# EAGLE design PCB-BI8-2x8 (EAGLE 7.7.0)

## Sheet 1 of 2
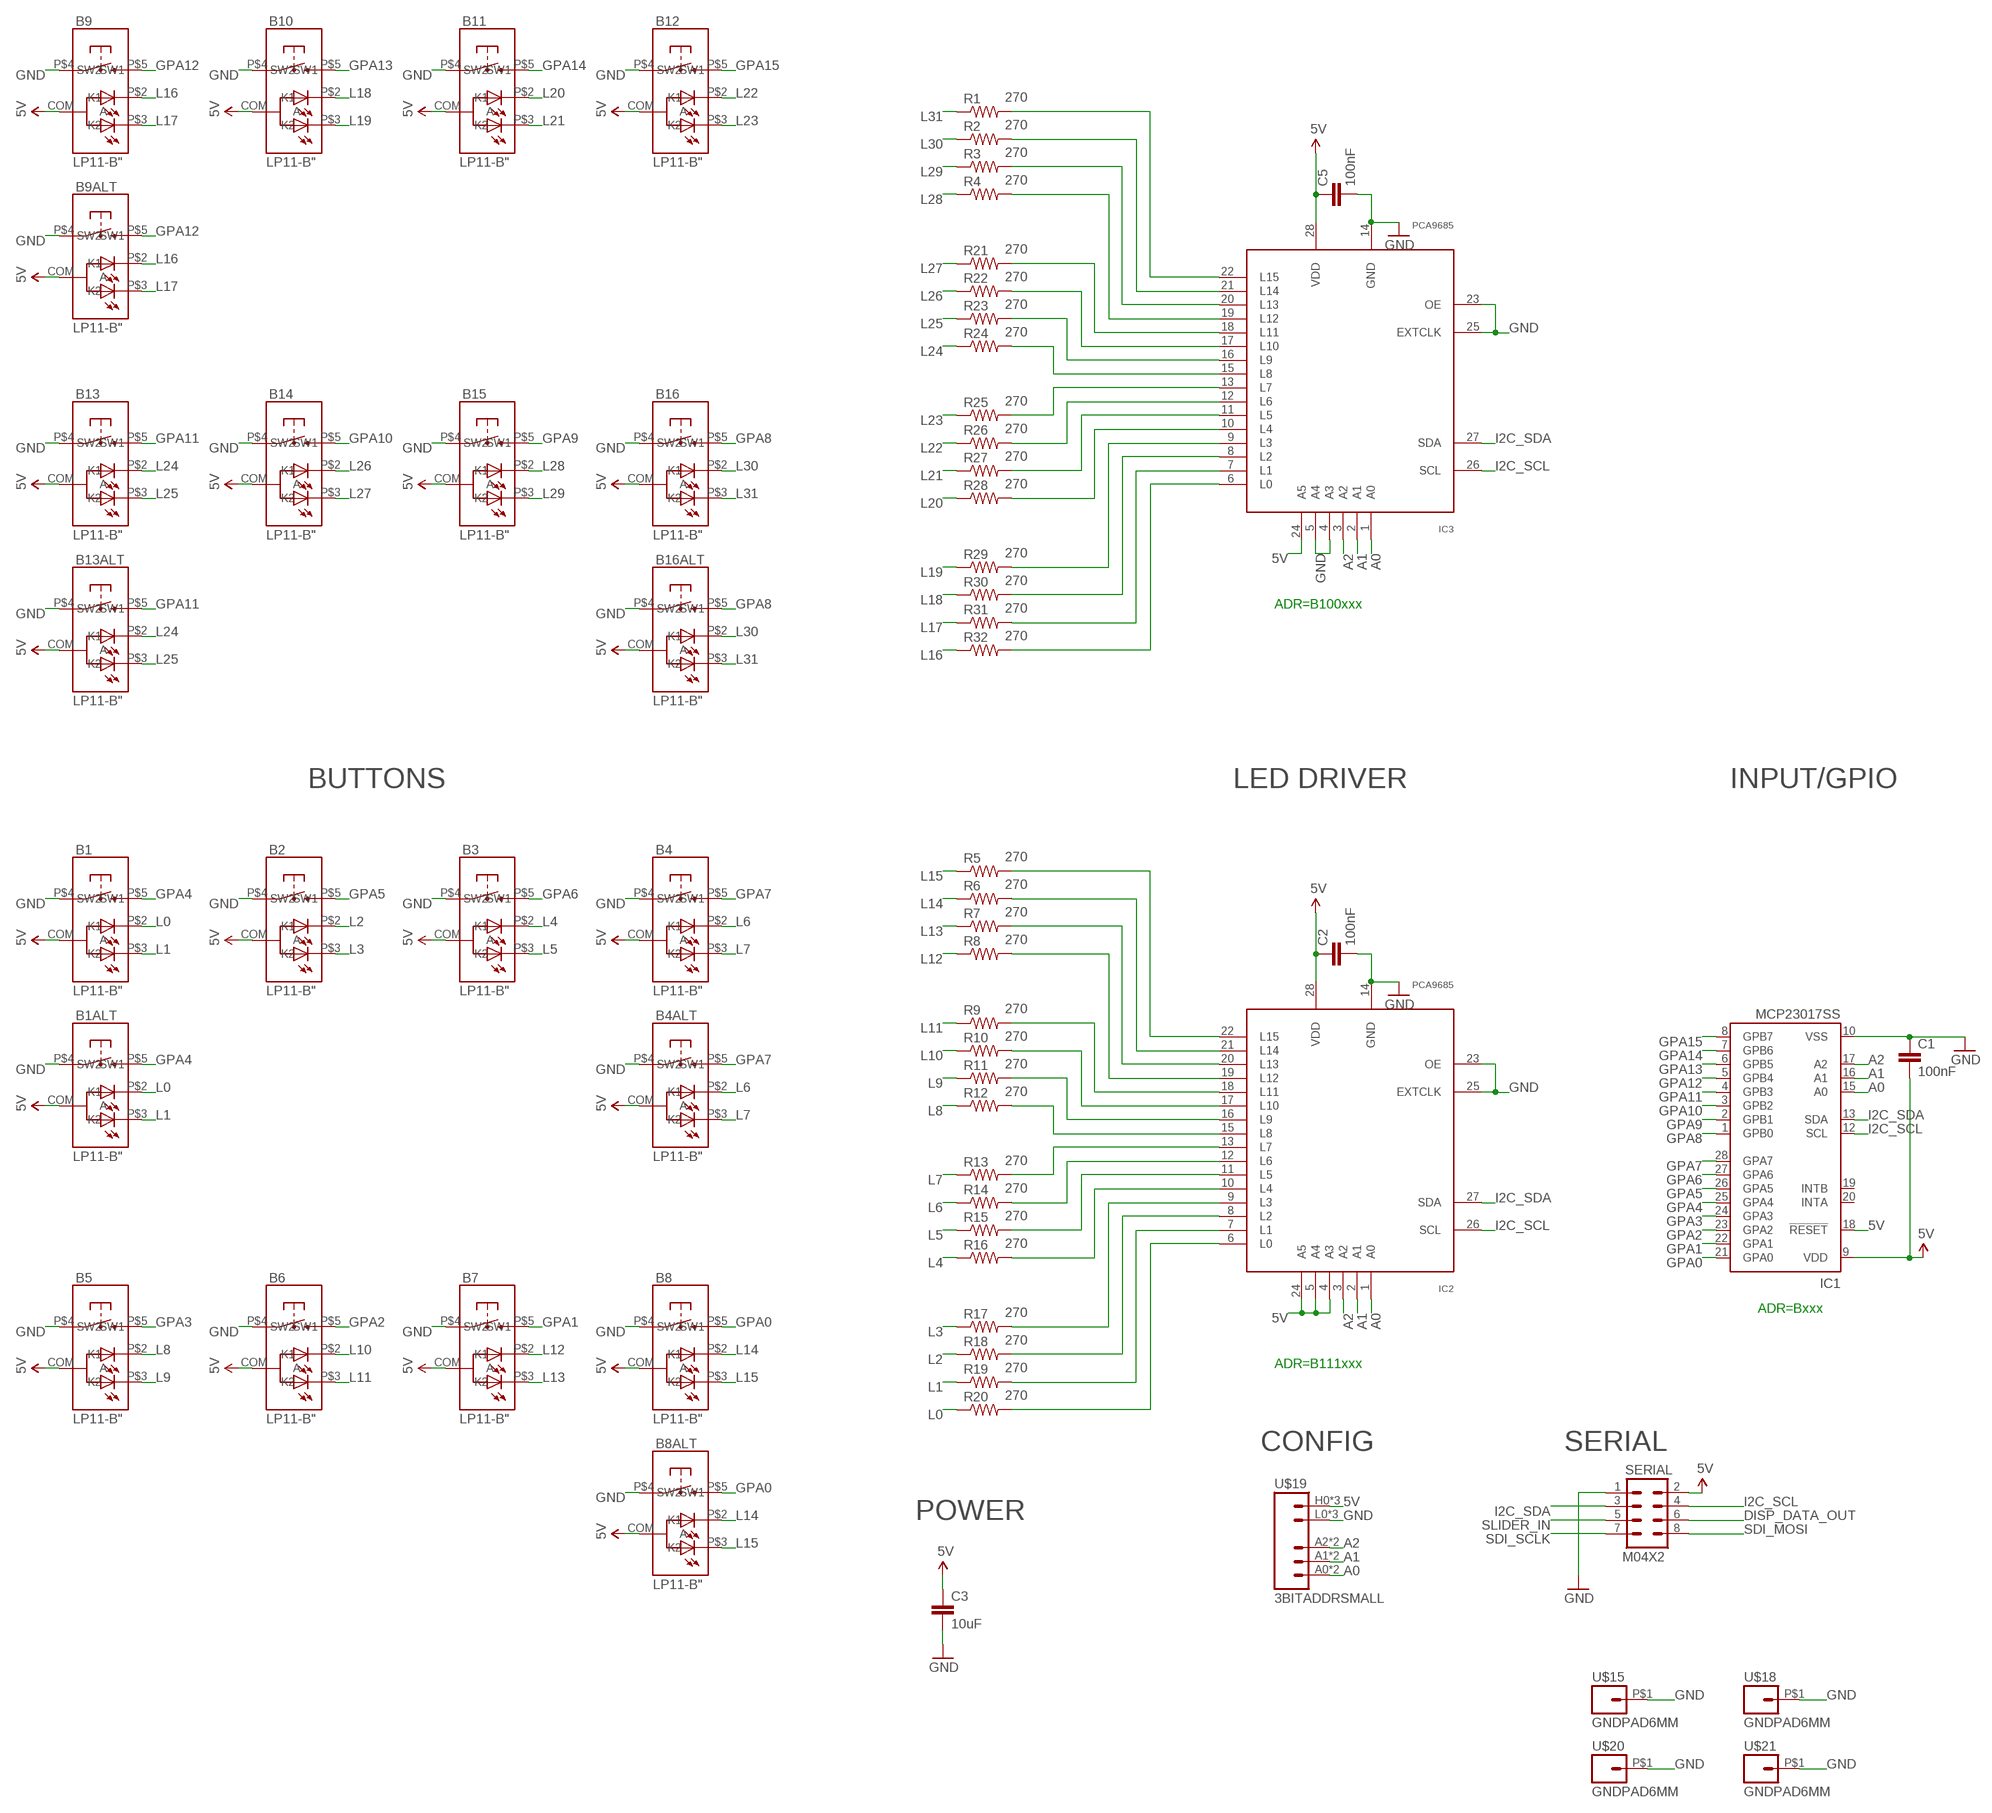
[diagram p0: schematic, sheet 1]

### Parts
B1  LP11-B"  [LP11]
B1ALT  LP11-B"  [LP11]
B2  LP11-B"  [LP11]
B3  LP11-B"  [LP11]
B4  LP11-B"  [LP11]
B4ALT  LP11-B"  [LP11]
B5  LP11-B"  [LP11]
B6  LP11-B"  [LP11]
B7  LP11-B"  [LP11]
B8  LP11-B"  [LP11]
B8ALT  LP11-B"  [LP11]
B9  LP11-B"  [LP11]
B9ALT  LP11-B"  [LP11]
B10  LP11-B"  [LP11]
B11  LP11-B"  [LP11]
B12  LP11-B"  [LP11]
B13  LP11-B"  [LP11]
B13ALT  LP11-B"  [LP11]
B14  LP11-B"  [LP11]
B15  LP11-B"  [LP11]
B16  LP11-B"  [LP11]
B16ALT  LP11-B"  [LP11]
C1  100nF  CAP0603-CAP  [0603-CAP]
C2  100nF  CAP0603-CAP  [0603-CAP]
C3  10uF  CAP0805  [0805]
C5  100nF  CAP0603-CAP  [0603-CAP]
IC1  MCP23017SS  [SSOP28]
IC2  PCA9685  [TSSOP28]
IC3  PCA9685  [TSSOP28]
R1  270  RESISTOR0603-RES  [0603-RES]
R2  270  RESISTOR0603-RES  [0603-RES]
R3  270  RESISTOR0603-RES  [0603-RES]
R4  270  RESISTOR0603-RES  [0603-RES]
R5  270  RESISTOR0603-RES  [0603-RES]
R6  270  RESISTOR0603-RES  [0603-RES]
R7  270  RESISTOR0603-RES  [0603-RES]
R8  270  RESISTOR0603-RES  [0603-RES]
R9  270  RESISTOR0603-RES  [0603-RES]
R10  270  RESISTOR0603-RES  [0603-RES]
R11  270  RESISTOR0603-RES  [0603-RES]
R12  270  RESISTOR0603-RES  [0603-RES]
R13  270  RESISTOR0603-RES  [0603-RES]
R14  270  RESISTOR0603-RES  [0603-RES]
R15  270  RESISTOR0603-RES  [0603-RES]
R16  270  RESISTOR0603-RES  [0603-RES]
R17  270  RESISTOR0603-RES  [0603-RES]
R18  270  RESISTOR0603-RES  [0603-RES]
R19  270  RESISTOR0603-RES  [0603-RES]
R20  270  RESISTOR0603-RES  [0603-RES]
R21  270  RESISTOR0603-RES  [0603-RES]
R22  270  RESISTOR0603-RES  [0603-RES]
R23  270  RESISTOR0603-RES  [0603-RES]
R24  270  RESISTOR0603-RES  [0603-RES]
R25  270  RESISTOR0603-RES  [0603-RES]
R26  270  RESISTOR0603-RES  [0603-RES]
R27  270  RESISTOR0603-RES  [0603-RES]
R28  270  RESISTOR0603-RES  [0603-RES]
R29  270  RESISTOR0603-RES  [0603-RES]
R30  270  RESISTOR0603-RES  [0603-RES]
R31  270  RESISTOR0603-RES  [0603-RES]
R32  270  RESISTOR0603-RES  [0603-RES]
SERIAL  M04X2  [2X4]
U$15  GNDPAD6MM  [3.2MMPAD6MM]
U$18  GNDPAD6MM  [3.2MMPAD6MM]
U$19  3BITADDRSMALL  [3BITADDR_SMALL]
U$20  GNDPAD6MM  [3.2MMPAD6MM]
U$21  GNDPAD6MM  [3.2MMPAD6MM]

### Nets
5V [Power]: B1.COM(A) B1ALT.COM(A) B2.COM(A) B3.COM(A) B4.COM(A) B4ALT.COM(A) B5.COM(A) B6.COM(A) B7.COM(A) B8.COM(A) B8ALT.COM(A) B9.COM(A) B9ALT.COM(A) B10.COM(A) B11.COM(A) B12.COM(A) B13.COM(A) B13ALT.COM(A) B14.COM(A) B15.COM(A) B16.COM(A) B16ALT.COM(A) C1.2 C2.1 C3.1 C5.1 IC1.9(VDD) IC1.18(!RESET) IC2.4(A3) IC2.5(A4) IC2.24(A5) IC2.28(VDD) IC3.24(A5) IC3.28(VDD) SERIAL.2 U$19.H0(VCC) U$19.H1(VCC) U$19.H2(VCC)
A0: IC1.15(A0) IC2.1(A0) IC3.1(A0) U$19.A0 U$19.AS0(A0)
A1: IC1.16(A1) IC2.2(A1) IC3.2(A1) U$19.A1 U$19.AS1(A1)
A2: IC1.17(A2) IC2.3(A2) IC3.3(A2) U$19.A2 U$19.AS2(A2)
DISP_DATA_OUT: SERIAL.6
GND [Power]: B1.P$4(SW1) B1ALT.P$4(SW1) B2.P$4(SW1) B3.P$4(SW1) B4.P$4(SW1) B4ALT.P$4(SW1) B5.P$4(SW1) B6.P$4(SW1) B7.P$4(SW1) B8.P$4(SW1) B8ALT.P$4(SW1) B9.P$4(SW1) B9ALT.P$4(SW1) B10.P$4(SW1) B11.P$4(SW1) B12.P$4(SW1) B13.P$4(SW1) B13ALT.P$4(SW1) B14.P$4(SW1) B15.P$4(SW1) B16.P$4(SW1) B16ALT.P$4(SW1) C1.1 C2.2 C3.2 C5.2 IC1.10(VSS) IC2.14(GND) IC2.23(OE) IC2.25(EXTCLK) IC3.4(A3) IC3.5(A4) IC3.14(GND) IC3.23(OE) IC3.25(EXTCLK) SERIAL.1 U$15.P$1 U$18.P$1 U$19.L0(GND) U$19.L1(GND) U$19.L2(GND) U$20.P$1 U$21.P$1
GPA0: B8.P$5(SW2) B8ALT.P$5(SW2) IC1.21(GPA0)
GPA1: B7.P$5(SW2) IC1.22(GPA1)
GPA2: B6.P$5(SW2) IC1.23(GPA2)
GPA3: B5.P$5(SW2) IC1.24(GPA3)
GPA4: B1.P$5(SW2) B1ALT.P$5(SW2) IC1.25(GPA4)
GPA5: B2.P$5(SW2) IC1.26(GPA5)
GPA6: B3.P$5(SW2) IC1.27(GPA6)
GPA7: B4.P$5(SW2) B4ALT.P$5(SW2) IC1.28(GPA7)
GPA8: B16.P$5(SW2) B16ALT.P$5(SW2) IC1.1(GPB0)
GPA9: B15.P$5(SW2) IC1.2(GPB1)
GPA10: B14.P$5(SW2) IC1.3(GPB2)
GPA11: B13.P$5(SW2) B13ALT.P$5(SW2) IC1.4(GPB3)
GPA12: B9.P$5(SW2) B9ALT.P$5(SW2) IC1.5(GPB4)
GPA13: B10.P$5(SW2) IC1.6(GPB5)
GPA14: B11.P$5(SW2) IC1.7(GPB6)
GPA15: B12.P$5(SW2) IC1.8(GPB7)
I2C_SCL: IC1.12(SCL) IC2.26(SCL) IC3.26(SCL) SERIAL.4
I2C_SDA: IC1.13(SDA) IC2.27(SDA) IC3.27(SDA) SERIAL.3
L0: B1.P$2(K1) B1ALT.P$2(K1) R20.1
L1: B1.P$3(K2) B1ALT.P$3(K2) R19.1
L2: B2.P$2(K1) R18.1
L3: B2.P$3(K2) R17.1
L4: B3.P$2(K1) R16.1
L5: B3.P$3(K2) R15.1
L6: B4.P$2(K1) B4ALT.P$2(K1) R14.1
L7: B4.P$3(K2) B4ALT.P$3(K2) R13.1
L8: B5.P$2(K1) R12.1
L9: B5.P$3(K2) R11.1
L10: B6.P$2(K1) R10.1
L11: B6.P$3(K2) R9.1
L12: B7.P$2(K1) R8.1
L13: B7.P$3(K2) R7.1
L14: B8.P$2(K1) B8ALT.P$2(K1) R6.1
L15: B8.P$3(K2) B8ALT.P$3(K2) R5.1
L16: B9.P$2(K1) B9ALT.P$2(K1) R32.1
L17: B9.P$3(K2) B9ALT.P$3(K2) R31.1
L18: B10.P$2(K1) R30.1
L19: B10.P$3(K2) R29.1
L20: B11.P$2(K1) R28.1
L21: B11.P$3(K2) R27.1
L22: B12.P$2(K1) R26.1
L23: B12.P$3(K2) R25.1
L24: B13.P$2(K1) B13ALT.P$2(K1) R24.1
L25: B13.P$3(K2) B13ALT.P$3(K2) R23.1
L26: B14.P$2(K1) R22.1
L27: B14.P$3(K2) R21.1
L28: B15.P$2(K1) R4.1
L29: B15.P$3(K2) R3.1
L30: B16.P$2(K1) B16ALT.P$2(K1) R2.1
L31: B16.P$3(K2) B16ALT.P$3(K2) R1.1
N$1: IC3.13(L7) R25.2
N$2: IC3.12(L6) R26.2
N$3: IC3.11(L5) R27.2
N$4: IC2.13(L7) R13.2
N$5: IC2.12(L6) R14.2
N$6: IC3.10(L4) R28.2
N$7: IC2.11(L5) R15.2
N$8: IC3.9(L3) R29.2
N$9: IC2.10(L4) R16.2
N$10: IC2.9(L3) R17.2
N$11: IC2.8(L2) R18.2
N$12: IC2.7(L1) R19.2
N$13: IC3.8(L2) R30.2
N$14: IC3.7(L1) R31.2
N$15: IC3.6(L0) R32.2
N$16: IC3.15(L8) R24.2
N$17: IC3.16(L9) R23.2
N$18: IC3.17(L10) R22.2
N$19: IC2.6(L0) R20.2
N$20: IC2.15(L8) R12.2
N$21: IC2.16(L9) R11.2
N$22: IC2.17(L10) R10.2
N$23: IC2.18(L11) R9.2
N$24: IC2.19(L12) R8.2
N$25: IC2.20(L13) R7.2
N$26: IC2.21(L14) R6.2
N$27: IC2.22(L15) R5.2
N$28: IC3.18(L11) R21.2
N$29: IC3.19(L12) R4.2
N$30: IC3.20(L13) R3.2
N$31: IC3.21(L14) R2.2
N$32: IC3.22(L15) R1.2
SDI_MOSI: SERIAL.8
SDI_SCLK: SERIAL.7
SLIDER_IN: SERIAL.5
Unconnected: IC1.19(INTB) IC1.20(INTA)

### Notes on the sheet
- ADR=B100xxx
- BUTTONS | LED DRIVER | INPUT/GPIO
- ADR=Bxxx
- ADR=B111xxx
- CONFIG | SERIAL
- POWER

## Sheet 2 of 2

## Library data of the parts
B1 B1ALT B2-B4 B4ALT B5-B8 B8ALT B9 B9ALT B10-B13 B13ALT B14-B16 B16ALT = SKAARHOJ:LP11-B
C1-C3 C5 = SparkFun:CAP: Capacitor Standard 0603 ceramic capacitor, and 0.1" leaded capacitor.
IC1 = microchip:MCP23017: http://ww1.microchip.com/downloads/en/DeviceDoc/21952a.pdf Source: http://ww1.microchip.com/downloads/en/DeviceDoc/21952a.pdf; MF: MICROCHIP; MPN: MCP23017-E/SS; OC_FARNELL: 1467674; OC_NEWARK: 31K2960
IC2 IC3 = wsmith:PCA9685
R1-R32 = SparkFun:RESISTOR: Resistor Basic schematic elements and footprints for 0603, 1206, and PTH resistors.
SERIAL = SparkFun:M04X2
U$15 U$18 U$20 U$21 = SKAARHOJ:GNDPAD
U$19 = SKAARHOJ:3BITADDR

## Net classes
0 default: width 0.203 mm, drill 0.406 mm, clearance 0.203 mm
1 Power: width 0.406 mm, drill 0.61 mm, clearance 0.203 mm

## Board
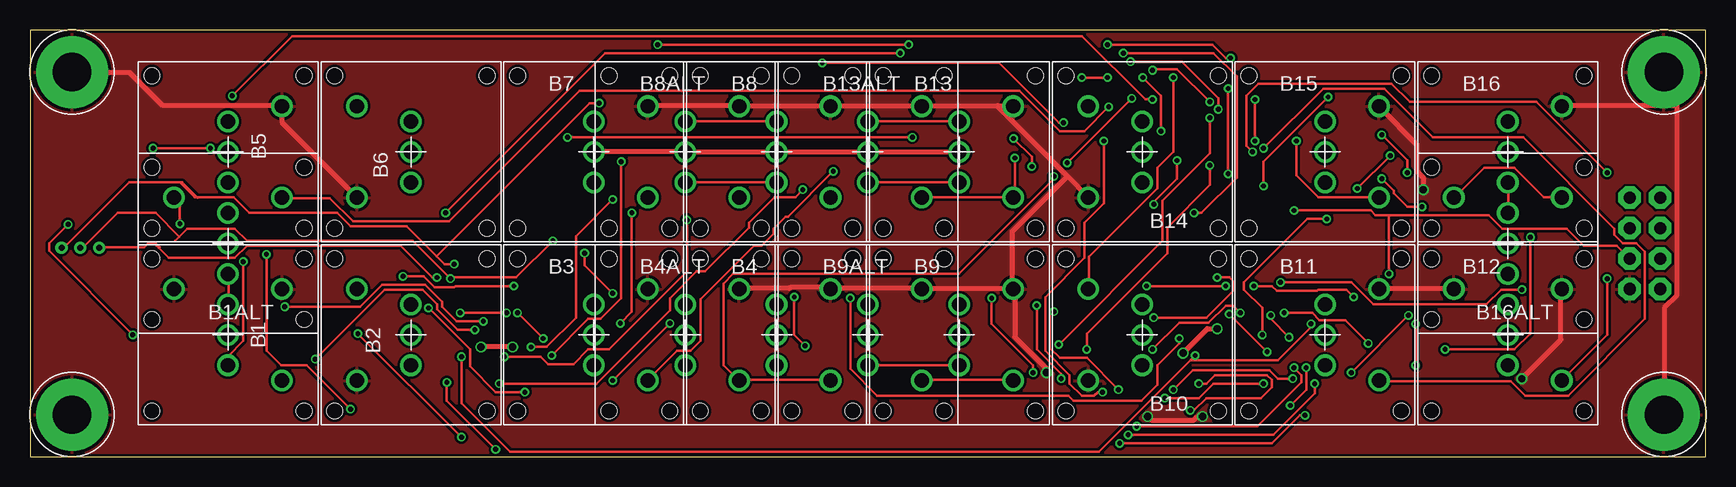
[diagram p1: board, top side]
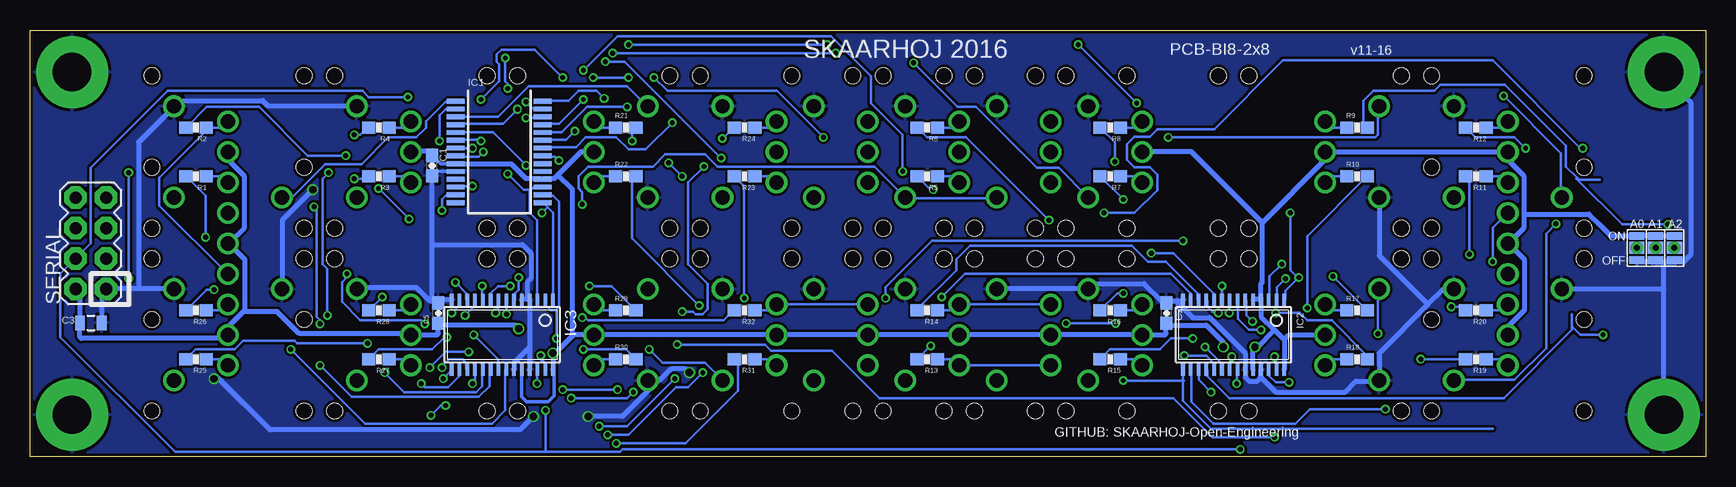
[diagram p2: board, bottom side, seen from below]

Size 139.7 x 35.56 mm. Coordinates in mm from the lower left corner, seen from the top.
Outline: 0,0 139.7,0 139.7,35.56 0,35.56 0,0
Copper layers (1*16): Top 0.035mm / dielectric 1.5mm / Bottom 0.035mm
Design rules "Fusion_eagle_rule_v1.1": minimum track width 6mil, minimum drill 12mil, track to track 6mil, track to pad 6mil, pad to pad 6mil, via to via 6mil, smd to smd 0mil, copper to edge 10mil, drill to drill 10mil, minimum pad ring 10mil, minimum via ring 6mil, stop-mask expansion 2mil, vias tented up to drill 100mil, thermal gap 10mil

### Footprints (pad centres in the part's own frame; a part is rotated, then mirrored left to right if it is on the bottom)
LP11 = drill 1.2: COM 0,0; P$2 0,2.54; P$3 0,-2.54; P$4 4.5,3.81; P$5 4.5,-3.81 | hole 1.3: -6.35,6.35; 6.35,6.35; 6.35,-6.35; -6.35,-6.35
0603-CAP = smd 1.1 x 1: 1 -0.85,0; 2 0.85,0
0805 = smd 0.8 x 1.2: 1 -0.9,0; 2 0.9,0
SSOP28 = smd 0.4 x 1.5: 1 -4.225,-3.625; 2 -3.575,-3.625; 3 -2.925,-3.625; 4 -2.275,-3.625; 5 -1.625,-3.625; 6 -0.975,-3.625; 7 -0.325,-3.625; 8 0.325,-3.625; 9 0.975,-3.625; 10 1.625,-3.625; 11 2.275,-3.625; 12 2.925,-3.625; 13 3.575,-3.625; 14 4.225,-3.625; 15 4.225,3.625; 16 3.575,3.625; 17 2.925,3.625; 18 2.275,3.625; 19 1.625,3.625; 20 0.975,3.625; 21 0.325,3.625; 22 -0.325,3.625; 23 -0.975,3.625; 24 -1.625,3.625; 25 -2.275,3.625; 26 -2.925,3.625; 27 -3.575,3.625; 28 -4.225,3.625
TSSOP28 = smd 0.305 x 0.991: 1 -4.225,-2.918; 2 -3.575,-2.918; 3 -2.925,-2.918; 4 -2.275,-2.918; 5 -1.625,-2.918; 6 -0.975,-2.918; 7 -0.325,-2.918; 8 0.325,-2.918; 9 0.975,-2.918; 10 1.625,-2.918; 11 2.275,-2.918; 12 2.925,-2.918; 13 3.575,-2.918; 14 4.225,-2.918; 15 4.225,2.918; 16 3.575,2.918; 17 2.925,2.918; 18 2.275,2.918; 19 1.625,2.918; 20 0.975,2.918; 21 0.325,2.918; 22 -0.325,2.918; 23 -0.975,2.918; 24 -1.625,2.918; 25 -2.275,2.918; 26 -2.925,2.918; 27 -3.575,2.918; 28 -4.225,2.918
0603-RES = smd 1.1 x 1: 1 -0.85,0; 2 0.85,0
2X4 = drill 1.016 pad 1.88 octagon: 1 -3.81,-1.27; 2 -3.81,1.27; 3 -1.27,-1.27; 4 -1.27,1.27; 5 1.27,-1.27; 6 1.27,1.27; 7 3.81,-1.27; 8 3.81,1.27
3.2MMPAD6MM = drill 3.2 pad 6: P$1 0,0
3BITADDR_SMALL = drill 0.5: A0 -1.565,0; A1 0,0; A2 1.565,0 | smd 1.27 x 1: AS0 -1.565,0; AS1 0,0; AS2 1.565,0 | smd 1.27 x 0.635: H0 -1.565,1; H1 0,1; H2 1.565,1; L0 -1.565,-1; L1 0,-1; L2 1.565,-1

### Placement (x,y rotation side)
B1  16.51,10.16 0 top
B1ALT  16.51,17.78 180 top
B2  31.75,10.16 180 top
B3  46.99,10.16 0 top
B4  62.23,10.16 0 top
B4ALT  54.61,10.16 0 top
B5  16.51,25.4 0 top
B6  31.75,25.4 180 top
B7  46.99,25.4 0 top
B8  62.23,25.4 0 top
B8ALT  54.61,25.4 0 top
B9  77.47,10.16 0 top
B9ALT  69.85,10.16 0 top
B10  92.71,10.16 180 top
B11  107.95,10.16 0 top
B12  123.19,10.16 0 top
B13  77.47,25.4 0 top
B13ALT  69.85,25.4 0 top
B14  92.71,25.4 180 top
B15  107.95,25.4 0 top
B16  123.19,25.4 0 top
B16ALT  123.19,17.78 180 top
C1  106.17,24.26 90 bottom
C2  44.96,11.96 90 bottom
C3  134.62,11.15 0 bottom
C5  105.66,11.96 90 bottom
IC1  100.58,25.4 270 bottom
IC2  39.37,10.16 180 bottom
IC3  100.33,10.16 180 bottom
R1  125.86,23.37 180 bottom
R2  125.86,27.43 180 bottom
R3  110.62,23.37 180 bottom
R4  110.62,27.43 180 bottom
R5  64.9,23.37 180 bottom
R6  64.9,27.43 180 bottom
R7  49.66,23.37 180 bottom
R8  49.66,27.43 180 bottom
R9  29.08,27.43 0 bottom
R10  29.08,23.37 0 bottom
R11  19.18,23.37 180 bottom
R12  19.18,27.43 180 bottom
R13  64.9,8.13 180 bottom
R14  64.9,12.19 180 bottom
R15  49.66,8.13 180 bottom
R16  49.66,12.19 180 bottom
R17  29.08,12.19 0 bottom
R18  29.08,8.13 0 bottom
R19  19.18,8.13 180 bottom
R20  19.18,12.19 180 bottom
R21  90.04,27.43 0 bottom
R22  90.04,23.37 0 bottom
R23  80.14,23.37 180 bottom
R24  80.14,27.43 180 bottom
R25  125.86,8.13 180 bottom
R26  125.86,12.19 180 bottom
R27  110.62,8.13 180 bottom
R28  110.62,12.19 180 bottom
R29  90.04,12.19 0 bottom
R30  90.04,8.13 0 bottom
R31  80.14,8.13 180 bottom
R32  80.14,12.19 180 bottom
SERIAL  134.62,17.78 90 bottom
U$15  3.5,3.5 0 top
U$18  136.2,3.5 0 top
U$19  4.19,17.4 0 bottom
U$20  3.5,32.06 0 top
U$21  136.2,32.06 0 top

### Tracks (layer width: path | path; a pad name or v marks a point on that pad's centre or on a via)
5V  (via drill 0.61)
  Top 0.406: v98.96,10.67 98.15,10.67 v96.11,8.64 | B7.COM B8ALT.COM B8.COM B13ALT.COM B13.COM | v40.23,9.14 v37.59,9.14
  Bottom 0.305: IC1.9 105.49,24.43 C1.2 | IC3.24 98.7,4.98 98.3,4.57 96.52,4.57 96.01,5.08 96.01,7.15 IC3.28
  Bottom 0.406: SERIAL.2 135.53,13.61 135.53,11.18 C3.1 135.53,10.97 135.53,9.96 135.43,9.86 123.55,9.86 123.34,10.06 B12.COM 123.14,10.16 123.14,10.87 121.82,12.19 | 121.82,12.19 121.82,16.46 123.14,17.78 B16ALT.COM 123.04,17.88 121.82,19.1 121.82,23.37 123.14,24.69 123.14,25.4 B16.COM | C1.2 106.17,25.5 107.8,25.5 107.9,25.4 B15.COM | 95.71,23.47 93.78,25.4 B14.COM | 95.71,23.47 96.01,23.16 96.93,23.16 IC1.18 97.13,23.16 98.35,23.16 99.57,24.38 104.14,24.38 IC1.9 | 94.39,10.16 96.01,8.53 | 96.01,8.53 96.11,8.43 96.11,7.32 IC3.28 | 94.39,10.16 B10.COM B9.COM B9ALT.COM B4.COM B4ALT.COM B3.COM 45.11,10.16 45.01,10.26 45.01,11.07 C2.1 44.91,10.97 41.66,10.97 40.23,9.55 v40.23,9.14 | v98.96,10.67 99.26,10.97 105.56,10.97 C5.1 105.66,10.26 105.77,10.16 B11.COM 108.1,10.26 117.25,10.26 119.08,12.09 121.72,12.09 121.82,12.19 | v96.11,8.64 96.01,8.53 | 95.71,23.47 94.49,22.25 94.49,10.26 94.39,10.16 | B1.COM 16.46,10.16 16.46,10.87 15.14,12.19 15.14,16.46 16.46,17.78 B1ALT.COM 16.36,17.88 15.14,19.1 15.14,20.22 | 15.14,20.22 15.14,23.37 16.46,24.69 16.46,25.4 B5.COM B6.COM 31.8,25.4 31.8,24.69 36.98,19.51 | 15.14,20.22 9.75,20.22 8.94,19.41 8.89,19.37 7.94,18.41 6.03,18.41 U$19.H0 5.71,18.41 4.45,18.41 U$19.H1 4.13,18.41 2.86,18.41 U$19.H2 | 35.15,9.75 35.15,7.32 IC2.28 | 35.97,10.57 37.08,11.68 37.08,13.01 IC2.4 | 35.97,10.57 35.15,9.75 | 35.97,10.57 37.49,9.04 | 37.49,9.04 37.8,8.74 37.8,7.32 IC2.24 | IC2.5 37.69,13.11 37.29,13.11 IC2.4 | B2.COM 34.75,10.16 35.15,9.75 | 36.98,19.51 36.98,14.53 37.08,14.43 37.08,13.21 IC2.4 | v37.59,9.14 37.49,9.04 | B7.COM 42.88,25.4 36.98,19.51
A0  (via drill 0.41)
  Top 0.203: v33.93,14.94 33.53,14.94 30.89,17.58 18.09,17.58 17.07,16.56 11.58,16.56 10.74,17.41 | 10.57,17.58 10.74,17.41 | v97.03,20.32 97.64,20.32 100.58,23.27 100.58,31.7 98.65,33.63 v91.14,33.63 | v72.54,33.63 47.95,33.63 v34.65,20.32 | U$19.AS0 6.03,17.46 9.53,17.46 9.84,17.78 10.48,17.78 10.79,17.46 10.74,17.41
  Bottom 0.203: 96.57,20.78 96.93,21.13 IC1.15 | 96.57,20.78 96.11,20.32 96.11,13.11 IC3.1 | IC2.1 35.05,13.11 35.05,13.82 v33.93,14.94 34.04,14.94 34.65,15.54 v34.65,20.32 | v97.03,20.32 96.57,20.78 | v72.54,33.63 v91.14,33.63 | 6.03,17.46 U$19.AS0
A1  (via drill 0.41)
  Top 0.203: 12.09,17.98 12.45,18.34 | 12.45,18.34 13.11,19 17.07,19 18.09,17.98 31.9,17.98 v35.05,14.83 35.05,14.94 40.54,14.94 v43.59,17.98 | v95.81,9.86 95.81,9.45 93.98,7.62 93.98,5.99 92.66,4.67 86.97,4.67 86.56,5.08 70.61,5.08 68.38,7.32 v68.38,13.21 | 12.45,18.34 10.48,20.32 7.3,20.32 4.45,17.46 U$19.AS1
  Bottom 0.203: 95.86,12.24 95.61,12.5 95.61,21.23 96.11,21.74 96.93,21.74 IC1.16 | 95.86,12.24 95.91,12.19 96.32,12.19 96.72,12.6 96.72,13.01 IC3.2 | v35.05,14.83 35.76,14.12 35.76,13.11 IC2.2 | v95.81,9.86 95.81,12.19 95.86,12.24 | v68.38,13.21 68.38,14.12 64.52,17.98 v43.59,17.98 | 4.45,17.46 U$19.AS1
A2  (via drill 0.41)
  Top 0.203: v35.36,16.05 34.54,16.05 33.88,16.71 | 33.88,16.71 31.39,19.2 26.72,19.2 25.6,20.32 18.29,20.32 16.97,21.64 13.97,21.64 | 13.97,21.64 13.72,21.64 12.5,22.86 | v99.87,30.68 v99.87,23.57 | v100.08,33.22 99.67,33.22 98.55,34.34 v89.81,34.34 | v52.32,34.34 v73.25,34.34 | v47.45,29.46 46.63,29.46 33.88,16.71 | U$19.AS2 2.86,17.46 8.26,22.86 12.7,22.86 13.97,21.59 13.97,21.64
  Bottom 0.203: 97.99,22.2 97.74,22.45 97.03,22.45 IC1.17 | 97.99,22.2 98.04,22.15 98.04,20.32 97.43,19.71 97.43,13.11 IC3.3 | v35.36,16.05 36.37,15.04 36.37,13.11 IC2.3 | v99.87,23.57 98.55,22.25 98.04,22.25 97.99,22.2 | v99.87,30.68 99.87,31.09 100.08,31.29 v100.08,33.22 | v73.25,34.34 v89.81,34.34 | v47.45,29.46 v52.32,34.34 | 2.86,17.46 U$19.AS2
GND  (via drill 0.61)
  Top 0.406: B16ALT.P$4 118.67,14.02 112.47,14.02 B11.P$4 | v116.13,22.25 116.13,23.27 115.62,23.77 115.62,26.01 112.47,29.16 B15.P$4 | U$18.P$1 136.25,3.56 136.25,12.39 137.26,13.41 137.26,30.99 136.25,32 U$21.P$1 137.16,29.26 127.71,29.26 B16.P$4 | 11.99,14.02 B1ALT.P$4 | 3.45,3.56 U$15.P$1 | B7.P$4 51.51,29.26 59.03,29.26 B8ALT.P$4 59.23,29.26 66.65,29.26 B8.P$4 66.85,29.26 74.27,29.26 B13ALT.P$4 74.47,29.26 80.67,29.26 | 80.67,29.26 81.89,29.26 B13.P$4 | 86.46,23.37 80.67,29.16 80.67,29.26 | 86.46,23.37 88.19,21.64 B14.P$4 | B6.P$4 27.23,21.64 21.03,27.84 21.03,29.16 B5.P$4 20.83,29.26 11.07,29.26 8.33,32 3.56,32 U$20.P$1 | B9.P$4 81.89,14.02 74.47,14.02 B9ALT.P$4 74.27,14.02 66.75,14.02 B4.P$4 66.65,14.12 63.4,14.12 63.3,14.02 59.13,14.02 B4ALT.P$4 | v84.73,7.01 84.73,7.32 82.09,9.96 82.09,13.82 B9.P$4 | 86.46,23.37 81.89,18.8 81.89,14.22 B9.P$4 | v124.36,6.5 127.61,9.75 127.61,13.92 B12.P$4 | v97.74,3.35 97.33,3.35 97.03,3.05 93.47,3.05 v93.17,3.35
  Bottom 0.305: IC1.10 105.8,23.77 C1.1
  Bottom 0.406: 98.04,9.04 98.04,13.01 IC3.4 98.25,13.11 | 98.04,9.04 98.04,7.32 IC3.25 | IC3.23 99.36,7.32 99.36,7.82 98.15,9.04 98.04,9.04 | 98.25,13.11 98.65,13.11 IC3.5 | 104.55,13.11 IC3.14 104.75,13.11 105.46,13.11 105.66,12.9 C5.2 105.77,13.01 106.17,13.01 | 106.17,13.01 106.38,13.01 107.49,14.12 112.27,14.12 112.37,14.02 B11.P$4 | 106.17,13.01 106.17,17.68 | 106.17,17.68 C1.1 | 98.25,13.11 98.25,14.53 97.94,14.83 97.94,16.97 98.65,17.68 106.17,17.68 | C3.2 133.71,11.18 133.71,13.61 SERIAL.1 133.2,14.02 130.66,14.02 | 130.66,14.02 127.71,14.02 B12.P$4 | B15.P$4 112.47,29.26 119.89,29.26 120.29,29.67 127.2,29.67 127.61,29.26 B16.P$4 127.81,29.06 130.66,26.21 130.66,14.02 | v116.13,22.25 118.67,19.71 118.67,14.02 B16ALT.P$4 | 3.45,32 U$20.P$1 3.49,31.75 1.27,29.53 1.27,16.83 1.91,16.19 2.54,16.19 U$19.L2 2.86,16.19 3.49,16.19 | 23.16,12.7 21.95,13.92 21.03,13.92 B1.P$4 | 23.16,12.7 27.23,8.64 27.23,6.4 B2.P$4 27.43,6.3 29.16,6.3 30.07,5.38 35.87,5.38 37.08,6.6 | 23.16,12.7 27.23,16.76 27.23,21.54 B6.P$4 | 37.08,6.6 37.08,7.21 IC2.25 | 37.08,6.6 37.39,6.3 38.1,6.3 38.41,6.6 38.41,7.21 IC2.23 38.41,7.42 38.41,8.64 41.35,11.58 42.77,11.58 44.09,12.9 44.09,13.01 | 44.09,13.01 44.81,13.01 44.91,12.9 C2.2 45.11,12.9 45.31,12.9 46.84,14.43 50.9,14.43 51.31,14.02 B3.P$4 51.51,14.02 59.03,14.02 B4ALT.P$4 | 44.09,13.01 43.69,13.01 IC2.14 | v84.73,7.01 85.04,7.32 86.26,7.32 87.17,6.4 88.19,6.4 B10.P$4 87.38,6.3 90.32,3.35 v93.17,3.35 | v124.36,6.5 123.95,6.5 119.69,2.23 98.86,2.23 v97.74,3.35 | 3.49,16.19 4.13,16.19 U$19.L1 4.45,16.19 5.71,16.19 U$19.L0 | 3.49,13.97 3.49,3.81 U$15.P$1
  Bottom 0.406: 3.49,13.97 3.49,16.19 | 3.49,13.97 B1ALT.P$4
  pour Top: 0,0 139.7,0 139.7,35.56 0,35.56
  pour Bottom: 0,0 139.7,0 139.7,35.56 0,35.56
GPA0  (via drill 0.41)
  Top 0.203: v95.61,24.69 95.61,23.16 93.67,21.23 v93.67,21.03
  Bottom 0.203: v95.61,24.69 95.91,24.99 96.93,24.99 IC1.21 | v93.67,21.03 93.67,22.05 93.98,22.35 93.98,23.37 93.17,24.18 87.78,24.18 86.77,25.2 83.41,25.2 82.4,24.18 69.29,24.18 66.75,21.64 B8.P$5 66.65,21.54 59.13,21.54 B8ALT.P$5
GPA1  (via drill 0.41)
  Top 0.203: v86.16,27.84 85.75,27.84 80.77,32.82 v66.04,32.82
  Bottom 0.203: v86.16,27.84 88.39,25.6 89.81,25.6 90.83,26.62 93.37,26.62 94.18,25.81 96.93,25.81 IC1.22 | v66.04,32.82 62.38,29.16 60.86,29.16 55.78,24.08 53.95,24.08 51.51,21.64 B7.P$5
GPA2  (via drill 0.41)
  Top 0.203: v94.28,27.13 94.28,30.07 v92.76,31.6 | v87.68,31.6 v89.81,31.6 | v44.81,26.62 v73.56,26.62
  Bottom 0.203: v94.28,27.13 95,26.42 96.93,26.42 IC1.23 | v89.81,31.6 v92.76,31.6 | v87.68,31.6 86.56,30.48 77.42,30.48 v73.56,26.62 | v44.81,26.62 27.53,26.62 27.33,26.82 27.33,29.16 B6.P$5
GPA3  (via drill 0.41)
  Top 0.203: v89.92,29.16 87.88,27.13 85.85,27.13 82.5,30.48 45.82,30.48 34.95,19.61 26.92,19.61 24.99,21.54 21.03,21.54 B5.P$5
  Bottom 0.203: v89.92,29.16 93.27,29.16 95.4,27.03 96.93,27.03 IC1.24
GPA4  (via drill 0.41)
  Top 0.203: v93.57,29.77 92.96,29.77 87.68,35.05 21.84,35.05 v16.87,30.07 | v12.5,19.41 12.5,21.13 12.09,21.54 B1ALT.P$5
  Bottom 0.203: v93.57,29.77 95.61,27.74 96.93,27.74 IC1.25 | v16.87,30.07 12.09,25.3 12.09,21.64 B1ALT.P$5 | v12.5,19.41 13.31,18.59 13.31,9.04 15.95,6.4 20.93,6.4 B1.P$5
GPA5  (via drill 0.41)
  Top 0.203: v98.35,28.25 98.35,25.3 94.39,21.34 94.39,17.98 v85.75,9.35 | v27.33,10.26 v35.97,1.63
  Bottom 0.203: v98.35,28.25 97.03,28.25 IC1.26 | v85.75,9.35 78.44,9.35 77.93,8.84 72.85,8.84 68.89,4.88 44.4,4.88 41.15,1.63 v35.97,1.63 | v27.33,10.26 27.33,13.92 B2.P$5
GPA6  (via drill 0.41)
  Top 0.203: v98.35,29.57 95.61,32.31 93.67,32.31 v93.57,32.21 | v66.95,23.77 63.2,20.02 62.99,20.02 61.98,19 61.98,18.59 60.96,17.58 60.35,17.58 55.88,13.11 55.88,9.65 55.07,8.84 53.95,8.84 51.51,6.4 B3.P$5
  Bottom 0.203: v98.35,29.57 97.84,29.06 97.03,29.06 IC1.27 | v93.57,32.21 90.73,35.05 72.95,35.05 69.6,31.7 69.6,29.46 66.95,26.82 v66.95,23.77
GPA7  (via drill 0.41)
  Top 0.203: v86.46,24.49 v91.85,29.87 | v85.34,23.37 85.34,23.16 77.42,15.24 58.62,15.24 57.81,14.43 57.81,7.62 59.03,6.4 B4ALT.P$5 59.13,6.4 66.65,6.4 B4.P$5
  Bottom 0.203: v91.85,29.87 92.46,30.48 93.98,30.48 94.79,29.67 96.93,29.67 IC1.28 | v85.34,23.37 v86.46,24.49
GPA8
  Top 0.203: B16.P$5 127.61,21.64 126.19,21.64 123.75,24.08 121.21,24.08 118.77,21.64 B16ALT.P$5
  Bottom 0.203: IC1.1 104.24,29.57 105.05,29.57 106.68,27.94 106.68,27.43 107.49,26.62 109.83,26.62 112.06,24.38 115.11,24.38 117.86,21.64 118.67,21.64 B16ALT.P$5
GPA9  (via drill 0.41)
  Top 0.203: v105.56,26.31 105.56,23.47 107.39,21.64 112.37,21.64 B15.P$5
  Bottom 0.203: v105.56,26.31 105.56,28.45 105.05,28.96 104.24,28.96 IC1.2
GPA10
  Bottom 0.203: IC1.3 104.14,28.35 100.69,28.35 98.15,30.89 89.92,30.89 88.29,29.26 B14.P$5
GPA11  (via drill 0.41)
  Top 0.203: v99.06,28.96 99.06,29.87 96.01,32.92 v91.75,32.92 | v82.09,24.89 82.09,21.74 81.99,21.64 B13.P$5 81.89,21.64 74.37,21.64 B13ALT.P$5
  Bottom 0.203: v99.06,28.96 100.28,27.74 104.14,27.74 IC1.4 | v91.75,32.92 90.12,32.92 v82.09,24.89
GPA12  (via drill 0.41)
  Top 0.203: v98.35,24.28 98.35,22.66 94.79,19.1 94.79,16.97 88.09,10.26 v88.09,8.94 | B9ALT.P$5 74.37,6.4 81.89,6.4 B9.P$5
  Bottom 0.203: v98.35,24.28 101.09,27.03 104.14,27.03 IC1.5 | v88.09,8.94 86.97,7.82 83.41,7.82 81.99,6.4 B9.P$5
GPA13  (via drill 0.41)
  Top 0.203: v102.11,29.77 v102.11,26.31 | v95.3,31.6 95.3,25.4 93.98,24.08 93.98,22.35 88.29,16.66 88.29,14.02 B10.P$5
  Bottom 0.203: v102.11,26.31 102.21,26.42 104.14,26.42 IC1.6 | v102.11,29.77 100.58,31.29 100.58,32.72 100.79,32.92 100.79,33.53 100.38,33.93 97.64,33.93 v95.3,31.6
GPA14  (via drill 0.41)
  Top 0.203: v102.82,25.7 107.8,30.68 112.88,30.68 116.94,26.62 124.46,26.62 132.08,19 132.08,18.49 132.79,17.78 133.91,17.78 134.62,17.07 134.62,11.48 128.22,5.08 124.66,5.08 123.44,6.3 112.47,6.3 B11.P$5
  Bottom 0.203: v102.82,25.7 104.14,25.7 IC1.7
GPA15  (via drill 0.41)
  Top 0.203: v101.91,25.4 101.4,25.91 101.4,30.07 102.41,31.09 113.49,31.09 115.01,29.57 125.58,29.57 v131.47,23.67 | v131.47,14.83 131.47,10.16 127.71,6.4 B12.P$5
  Bottom 0.203: v101.91,25.4 102.31,24.99 104.14,24.99 IC1.8 | v131.47,14.83 v131.47,23.67
I2C_SCL  (via drill 0.41)
  Top 0.203: v102.82,22.55 102.82,24.59 v108.2,29.97 | v34.75,6.2 34.75,4.67 v38.81,0.61 | v97.43,6.1 98.04,6.1 98.75,6.81 103.12,6.81 103.53,6.4 103.53,5.79 102.62,4.88 98.04,4.88 97.03,3.86 v96.72,3.86
  Bottom 0.203: v102.82,22.55 104.14,22.55 IC1.12 | v108.2,29.97 111.45,29.97 111.96,30.48 128.22,30.48 134.62,24.08 134.62,17.78 SERIAL.4 137.16,15.24 137.16,9.96 127.61,0.41 96.72,0.41 | v34.75,6.2 35.87,6.2 36.37,6.71 36.37,7.21 IC2.26 | v38.81,0.61 90.32,0.61 90.53,0.41 96.72,0.41 | v97.43,6.1 97.43,7.21 IC3.26 | 96.72,0.41 v96.72,3.86
I2C_SDA  (via drill 0.41)
  Top 0.203: v105.36,20.52 111.76,20.52 112.17,20.12 113.28,20.12 | 113.28,20.12 121.61,20.12 122.73,19 128.12,19 129.54,17.58 132.28,17.58 SERIAL.3 | v35.97,8.33 35.97,4.47 40.03,0.41 89.1,0.41 96.77,8.08 | v97.13,8.43 96.77,8.08 | v113.28,15.24 113.28,20.12 | v106.78,11.07 106.78,10.77 104.04,8.03 96.83,8.03 96.77,8.08
  Bottom 0.203: v105.36,20.52 105.36,21.44 105.05,21.74 104.24,21.74 IC1.13 | v35.97,8.33 35.87,8.23 35.87,7.32 IC2.27 | v97.13,8.43 97.13,8.13 96.83,7.82 96.83,7.32 IC3.27 | v113.28,15.24 113.28,14.94 113.69,14.53 113.69,12.9 112.17,11.38 107.09,11.38 v106.78,11.07
L0
  Top 0.203: B1.P$2 16.56,12.7 16.56,15.24 B1ALT.P$2
  Bottom 0.203: R20.1 17.07,12.19 16.56,12.7 B1.P$2
L1  (via drill 0.41)
  Top 0.203: v17.78,16.26 17.78,9.65 16.56,8.43 16.56,7.62 B1.P$3
  Bottom 0.203: R19.1 17.07,8.13 16.56,7.62 B1.P$3 | v17.78,16.26 17.78,19.1 16.56,20.32 B1ALT.P$3
L2
  Bottom 0.203: R18.1 31.19,8.13 31.7,7.62 B2.P$2
L3
  Bottom 0.203: R17.1 31.19,12.19 31.7,12.7 B2.P$3
L4
  Bottom 0.203: R16.1 47.55,12.19 47.04,12.7 B3.P$2
L5
  Bottom 0.203: R15.1 47.55,8.13 47.04,7.62 B3.P$3
L6
  Bottom 0.203: R14.1 62.79,12.19 62.28,12.7 B4.P$2 B4ALT.P$2
L7
  Bottom 0.203: R13.1 62.79,8.13 62.28,7.62 B4.P$3 B4ALT.P$3
L8
  Bottom 0.203: R12.1 17.07,27.43 16.56,27.94 B5.P$2
L9
  Bottom 0.203: R11.1 17.07,23.37 16.56,22.86 B5.P$3
L10
  Bottom 0.203: R10.1 31.19,23.37 31.7,22.86 B6.P$2
L11
  Bottom 0.203: R9.1 31.19,27.43 31.7,27.94 B6.P$3
L12
  Bottom 0.203: R8.1 47.55,27.43 47.04,27.94 B7.P$2
L13
  Bottom 0.203: R7.1 47.55,23.37 47.04,22.86 B7.P$3
L14
  Top 0.203: B8.P$2 B8ALT.P$2
  Bottom 0.203: R6.1 62.79,27.43 62.28,27.94 B8.P$2
L15
  Top 0.203: B8.P$3 B8ALT.P$3
  Bottom 0.203: R5.1 62.79,23.37 62.28,22.86 B8.P$3
L16
  Bottom 0.203: R32.1 78.03,12.19 77.52,12.7 B9.P$2 B9ALT.P$2
L17
  Top 0.203: B9.P$3 B9ALT.P$3
  Bottom 0.203: R31.1 78.03,8.13 77.52,7.62 B9.P$3
L18
  Bottom 0.203: R30.1 92.15,8.13 92.66,7.62 B10.P$2
L19
  Bottom 0.203: R29.1 92.15,12.19 92.66,12.7 B10.P$3
L20
  Bottom 0.203: R28.1 108.51,12.19 108,12.7 B11.P$2
L21
  Bottom 0.203: R27.1 108.51,8.13 108,7.62 B11.P$3
L22
  Bottom 0.203: R26.1 123.75,12.19 123.24,12.7 B12.P$2
L23
  Bottom 0.203: R25.1 123.75,8.13 123.24,7.62 B12.P$3
L24
  Top 0.203: B13.P$2 B13ALT.P$2
  Bottom 0.203: R24.1 78.03,27.43 77.52,27.94 B13.P$2
L25
  Top 0.203: B13.P$3 B13ALT.P$3
  Bottom 0.203: R23.1 78.03,23.37 77.52,22.86 B13.P$3
L26
  Bottom 0.203: R22.1 92.15,23.37 92.66,22.86 B14.P$2
L27
  Bottom 0.203: R21.1 92.15,27.43 92.66,27.94 B14.P$3
L28
  Bottom 0.203: R4.1 108.51,27.43 108,27.94 B15.P$2
L29
  Bottom 0.203: R3.1 108.51,23.37 108,22.86 B15.P$3
L30
  Bottom 0.203: 124.77,27.43 123.75,27.43 123.24,27.94 B16.P$2 | 124.77,27.43 R2.1 124.97,27.43 | 124.77,27.43 128.93,23.27 128.93,20.93 123.24,15.24 B16ALT.P$2
L31
  Top 0.203: B16ALT.P$3 123.24,20.32 123.24,22.86 B16.P$3
  Bottom 0.203: R1.1 123.75,23.37 123.24,22.86 B16.P$3
N$1  (via drill 0.41)
  Top 0.203: v104.55,11.99 106.88,11.99 107.49,11.38 109.63,11.38 v111.56,9.45
  Bottom 0.203: v104.55,11.99 103.94,12.6 103.94,13.01 IC3.13 | v111.56,9.45 117.45,9.45 117.65,9.65 121.92,9.65 122.63,8.94 125.88,8.94 126.69,8.13 R25.2
N$2  (via drill 0.41)
  Top 0.203: v104.24,14.53 110.13,14.53 111.96,12.7 121.41,12.7 122.63,13.92 v124.36,13.92
  Bottom 0.203: v104.24,14.53 103.33,13.61 103.33,13.11 IC3.12 | v124.36,13.92 124.97,13.92 126.69,12.19 R26.2
N$3  (via drill 0.41)
  Top 0.203: v103.43,11.79 103.43,11.48 v104.95,9.96
  Bottom 0.203: v103.43,11.79 102.62,12.6 102.62,13.01 IC3.11 | v104.95,9.96 105.16,9.96 106.17,8.94 110.64,8.94 111.45,8.13 R27.2
N$4  (via drill 0.41)
  Top 0.203: v63.7,13.31 63.7,10.16 v64.62,9.25
  Bottom 0.203: v63.7,13.31 61.77,15.24 44.6,15.24 42.98,13.61 42.98,13.11 IC2.13 | v64.62,9.25 65.73,8.13 R13.2
N$5
  Bottom 0.203: IC2.12 42.37,13.11 42.37,13.61 45.01,16.26 46.53,16.26 47.85,17.58 61.37,17.58 62.48,16.46 62.48,15.54 65.84,12.19 R14.2
N$6  (via drill 0.41)
  Top 0.203: v102.01,14.22 103.53,14.22 103.94,13.82 107.29,13.82 107.39,13.92 109.73,13.92 v110.34,13.31
  Bottom 0.203: v102.01,14.22 102.01,13.11 IC3.10 | v110.34,13.31 111.45,12.19 R28.2
N$7  (via drill 0.41)
  Top 0.203: v42.77,9.86 v40.64,11.99
  Bottom 0.203: v40.64,11.99 40.74,12.09 41.15,12.09 41.55,12.5 41.55,13.01 IC2.11 | v42.77,9.86 44.6,9.86 45.52,8.94 49.68,8.94 50.49,8.13 R15.2
N$8  (via drill 0.41)
  Top 0.203: v93.07,14.22 v99.67,14.22
  Bottom 0.203: v99.67,14.22 100.69,14.22 101.3,13.61 101.3,13.11 IC3.9 | v93.07,14.22 91.24,14.22 89.2,12.19 R29.2
N$9  (via drill 0.41)
  Top 0.203: v46.23,16.97 46.23,15.95 v48.56,13.61
  Bottom 0.203: v46.23,16.97 44.4,16.97 41.05,13.61 41.05,13.11 IC2.10 | v48.56,13.61 49.07,13.61 50.49,12.19 R16.2
N$10  (via drill 0.41)
  Top 0.203: v40.34,14.22 35.46,14.22 35.36,14.12 33.73,14.12 32.82,15.04 v31.09,15.04
  Bottom 0.203: v40.34,14.22 40.34,13.11 IC2.9 | v31.09,15.04 28.25,12.19 R17.2
N$11  (via drill 0.41)
  Top 0.203: v35.87,11.99 v39.73,11.99
  Bottom 0.203: v39.73,11.99 39.73,13.01 IC2.8 | v35.87,11.99 33.83,11.99 33.22,11.38 31.19,11.38 28.25,8.43 28.25,8.13 R18.2
N$12  (via drill 0.41)
  Top 0.203: v37.08,10.57 35.66,10.57 33.93,12.29 33.93,12.7 32.72,13.92 29.57,13.92 v23.77,8.13
  Bottom 0.203: v37.08,10.57 38.1,10.57 39.01,11.48 39.01,13.01 IC2.7 | R19.2 v23.77,8.13
N$13  (via drill 0.41)
  Top 0.203: v100.89,11.99 100.28,12.6 99.67,12.6 98.25,11.18 95.81,11.18 v93.57,8.94
  Bottom 0.203: v100.89,11.99 100.69,12.19 100.69,13.01 IC3.8 | v93.57,8.94 90.02,8.94 89.2,8.13 R30.2
N$14  (via drill 0.41)
  Top 0.203: v103.12,8.74 v99.97,11.89 | v106.38,7.42 106.38,5.59 v105.05,4.27 | v106.27,3.45 105.87,3.45 103.53,1.12 v90.83,1.12
  Bottom 0.203: v99.97,11.89 99.97,13.01 IC3.7 | v103.12,8.74 105.05,8.74 v106.38,7.42 | v105.05,4.27 105.46,4.27 v106.27,3.45 | v90.83,1.12 85.04,1.12 80.67,5.49 80.67,7.82 80.97,8.13 R31.2
N$15  (via drill 0.41)
  Top 0.203: v98.96,14.94 99.97,14.94 100.38,14.53 100.38,13.92 98.04,11.58 v93.67,11.58
  Bottom 0.203: v98.96,14.94 98.96,13.92 99.26,13.61 99.26,13.11 IC3.6 | v93.67,11.58 93.37,11.58 93.17,11.38 81.89,11.38 81.08,12.19 R32.2
N$16  (via drill 0.41)
  Top 0.203: v105.26,6.5 104.04,6.5 103.33,7.21 96.93,7.21 v95.3,5.59 | v90.73,5.59 88.09,8.23 85.85,8.23 85.04,9.04 85.04,11.79 v85.34,12.09 | v83.52,24.18 83.52,24.99 v81.99,26.52
  Bottom 0.203: v105.26,6.5 104.65,7.11 104.65,7.21 IC3.15 | v90.73,5.59 v95.3,5.59 | v85.34,12.09 84.43,12.09 84.23,11.89 83.62,11.89 83.21,12.29 83.21,14.43 84.84,16.05 84.84,22.86 v83.52,24.18 | v81.99,26.52 81.08,27.43 R24.2
N$17  (via drill 0.41)
  Top 0.203: v107.09,6.1 107.09,5.28 103.63,1.83 v91.54,1.83 | v83.62,7.01 83.62,7.62 80.16,11.07 v80.16,13.21
  Bottom 0.203: v107.09,6.1 106.78,5.79 104.85,5.79 103.94,6.71 103.94,7.21 IC3.16 | v91.54,1.83 89.81,1.83 85.85,5.79 84.84,5.79 v83.62,7.01 | v80.16,13.21 80.16,22.55 80.97,23.37 R23.2
N$18  (via drill 0.41)
  Top 0.203: v105.36,7.42 105.97,6.81 105.97,6.2 102.31,2.54 v92.25,2.54 | v85.95,6.5 85.95,6.91 83.92,8.94 v83.92,12.6
  Bottom 0.203: v105.36,7.42 105.36,7.52 104.75,8.13 103.63,8.13 103.33,7.82 103.33,7.32 IC3.17 | v92.25,2.54 89.92,2.54 v85.95,6.5 | v83.92,12.6 89.51,18.19 89.51,23.06 89.2,23.37 R22.2
N$19  (via drill 0.41)
  Top 0.203: v37.8,11.28 35.56,11.28 34.34,12.5 34.34,12.9 32.92,14.33 29.36,14.33 27.53,12.5 v21.23,12.5
  Bottom 0.203: v37.8,11.28 38.3,11.79 38.3,13.01 IC2.6 | v21.23,12.5 20.42,12.5 20.12,12.19 R20.2
N$20  (via drill 0.41)
  Top 0.203: v15.04,25.7 v10.26,25.7 | v50.16,20.32 50.16,12.06 v49.21,11.11 | v48.58,6.35 v53.34,11.11
  Bottom 0.203: 43.59,6.35 43.59,4.67 41.25,2.34 17.78,2.34 | 43.59,6.35 43.59,7.21 IC2.15 | v15.04,25.7 15.95,26.62 19.2,26.62 20.02,27.43 R12.2 | v50.16,20.32 47.62,20.32 45.72,22.23 45.72,23.5 46.35,24.13 47.62,24.13 48.26,24.77 48.26,26.04 47.62,26.67 46.35,26.67 45.72,27.3 40.96,27.3 35.24,33.02 17.78,33.02 10.48,25.72 v10.26,25.7 | v53.34,11.11 v49.21,11.11 | 43.59,6.35 v48.58,6.35 | 43.5,6.35 43.59,6.35
N$21  (via drill 0.41)
  Top 0.203: v26.72,3.96 23.06,7.62 20.93,7.62 19.71,8.84 v19.71,16.87
  Bottom 0.203: v26.72,3.96 33.02,3.96 34.24,2.74 41.05,2.74 42.88,4.57 42.88,7.21 IC2.16 | v19.71,16.87 19.71,23.06 20.02,23.37 R11.2
N$22  (via drill 0.41)
  Top 0.203: v41.25,5.38 38.81,5.38 36.68,7.52 36.68,8.94 v33.22,12.39
  Bottom 0.203: v41.25,5.38 42.27,6.4 42.27,7.21 IC2.17 | v33.22,12.39 33.22,18.39 28.25,23.37 R10.2
N$23  (via drill 0.41)
  Top 0.203: v3.17,19.37 1.59,17.78 1.59,17.14 v8.57,10.16
  Bottom 0.203: 11.18,11.89 11.18,10.79 | 11.18,10.79 11.18,10.57 16.87,4.88 39.73,4.88 41.55,6.71 41.55,7.21 IC2.18 | 8.84,23.06 10.57,23.06 10.74,23.23 | 10.74,23.23 11.68,24.18 11.68,25.91 16.76,30.99 22.15,30.99 22.66,30.48 27.74,30.48 28.55,29.67 28.55,27.74 28.25,27.43 R9.2 | v3.17,19.37 6.99,19.37 10.79,23.18 10.74,23.23 | v8.57,10.16 10.48,10.16 11.11,10.79 11.18,10.79
N$24  (via drill 0.41)
  Top 0.203: v43.48,8.43 46.53,11.48 47.55,11.48 49.28,13.21 v49.28,24.59
  Bottom 0.203: v43.48,8.43 41.66,8.43 41.05,7.82 41.05,7.32 IC2.19 | v49.28,24.59 49.28,26.21 50.49,27.43 R8.2
N$25  (via drill 0.41)
  Top 0.203: v41.76,9.14 43.08,9.14 45.52,11.58 45.52,18.39 v48.56,21.44
  Bottom 0.203: v41.76,9.14 40.44,7.82 40.44,7.32 IC2.20 | v48.56,21.44 50.49,23.37 R7.2
N$26  (via drill 0.41)
  Top 0.203: v39.52,8.33 42.57,8.33 43.18,7.72 45.31,7.72 46.53,8.94 48.26,8.94 54.76,15.44 v54.76,19.71
  Bottom 0.203: v39.52,8.33 39.62,8.23 39.62,7.32 IC2.21 | v54.76,19.71 61.67,26.62 64.92,26.62 65.73,27.43 R6.2
N$27  (via drill 0.41)
  Top 0.203: v39.12,6.1 47.24,6.1 53.34,12.19 53.34,13.21 55.58,15.44 56.29,15.44 59.94,19.1 59.94,19.51 62.08,21.64 63.8,21.64 v64.41,22.25
  Bottom 0.203: v39.12,6.1 39.12,7.21 IC2.22 | v64.41,22.25 64.62,22.25 65.73,23.37 R5.2
N$28  (via drill 0.41)
  Top 0.203: v102.82,6.1 98.65,6.1 97.43,4.88 v94.59,4.88 | v89.41,5.38 89,5.38 88.7,5.08 87.68,5.08 86.67,6.1 86.67,6.81 84.63,8.84 84.63,13.31 87.88,16.56 87.88,19.51 89.51,21.13 v89.51,26.31
  Bottom 0.203: v102.82,6.1 102.62,6.3 102.62,7.21 IC3.18 | v94.59,4.88 89.92,4.88 v89.41,5.38 | v89.51,26.31 89.51,27.13 89.2,27.43 R21.2
N$29  (via drill 0.41)
  Top 0.203: v114.91,11.79 v110.13,7.01 | v114.81,23.67 114.81,24.69 v112.67,26.82
  Bottom 0.203: v110.13,7.01 108.51,5.38 102.51,5.38 102.01,5.89 102.01,7.21 IC3.19 | v114.91,11.79 114.91,15.65 115.32,16.05 115.32,23.16 v114.81,23.67 | v112.67,26.82 112.17,26.82 111.56,27.43 R4.2
N$30  (via drill 0.41)
  Top 0.203: v115.52,11.07 v115.52,7.62 | v116.03,20.83 114.81,20.83 113.69,21.95 113.69,22.15 v112.67,23.16
  Bottom 0.203: v115.52,7.62 112.88,4.98 102.31,4.98 101.4,5.89 101.4,7.21 IC3.20 | v115.52,11.07 115.52,11.38 115.82,11.68 115.82,20.62 v116.03,20.83 | v112.67,23.16 111.76,23.16 111.56,23.37 R3.2
N$31  (via drill 0.41)
  Top 0.203: v102.72,10.16 102.72,12.39 101.19,13.92 101.19,14.53 106.48,19.81 v108.1,19.81 | v113.39,25.09 v110.64,22.35
  Bottom 0.203: v102.72,10.16 100.69,8.13 100.69,7.32 IC3.21 | v110.64,22.35 v108.1,19.81 | v113.39,25.09 116.53,25.09 120.6,29.16 124.97,29.16 126.69,27.43 R2.2
N$32  (via drill 0.41)
  Top 0.203: v117.96,8.94 123.75,8.94 125.07,10.26 v125.07,18.29
  Bottom 0.203: v117.96,8.94 111.76,2.74 101.19,2.74 100.08,3.86 100.08,7.21 IC3.22 | v125.07,18.29 125.07,21.74 126.69,23.37 R1.2

### Text on the board
_bsilk: v11-16 | PCB-BI8-2x8 | SKAARHOJ 2016 | GITHUB: SKAARHOJ-Open-Engineering